# EAGLE design 27CXXX (EAGLE 6.6.0)
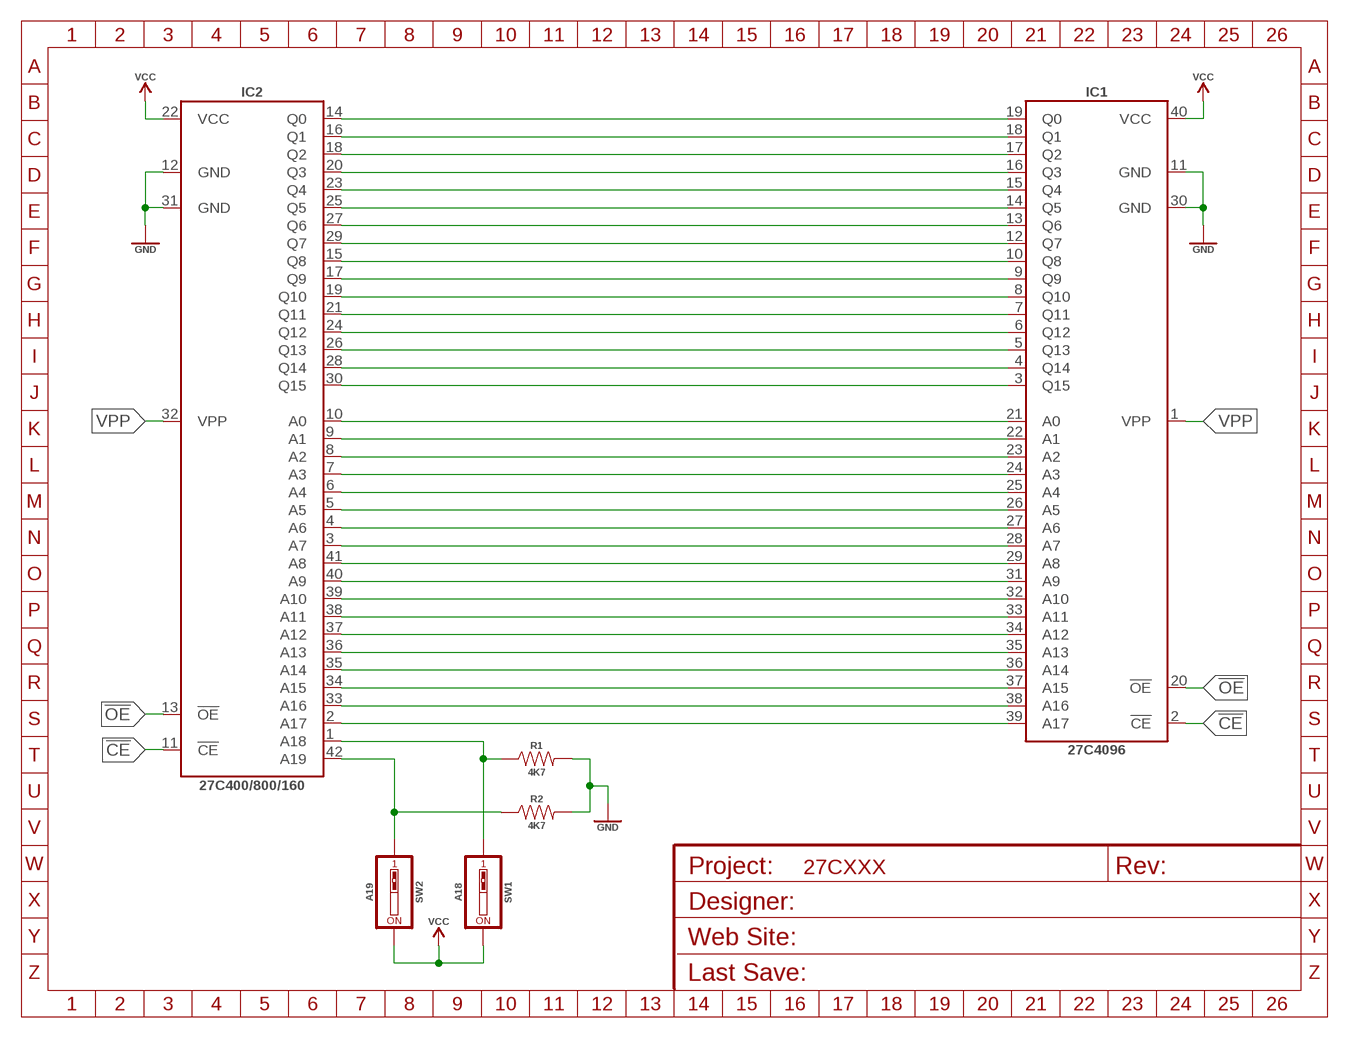
[diagram p0: schematic, sheet 1]
FRAME1 (A5L_FRAME): DESIGNER: Simon/CGTr; REVISION: 1.0; WEBSITE: http://www.commodore.gen.tr

## Parts
IC1  27C4096  27C4096_DIP  [DIP40W]
IC2  27C400/800/160  27C160_ZIF42F  [ZIF42F]
R1  4K7  RESISTOR_THT_0.3  [RESISTOR_0.3]
R2  4K7  RESISTOR_THT_0.3  [RESISTOR_0.3]
SW1  A18  SWITCH_DIP_01  [SWITCH_DIP_01]
SW2  A19  SWITCH_DIP_01  [SWITCH_DIP_01]

## Nets
!CE: IC1.2(!CE) IC2.11(!CE)
!OE: IC1.20(!OE) IC2.13(!OE)
A0: IC1.21(A0) IC2.10(A0)
A1: IC1.22(A1) IC2.9(A1)
A2: IC1.23(A2) IC2.8(A2)
A3: IC1.24(A3) IC2.7(A3)
A4: IC1.25(A4) IC2.6(A4)
A5: IC1.26(A5) IC2.5(A5)
A6: IC1.27(A6) IC2.4(A6)
A7: IC1.28(A7) IC2.3(A7)
A8: IC1.29(A8) IC2.41(A8)
A9: IC1.31(A9) IC2.40(A9)
A10: IC1.32(A10) IC2.39(A10)
A11: IC1.33(A11) IC2.38(A11)
A12: IC1.34(A12) IC2.37(A12)
A13: IC1.35(A13) IC2.36(A13)
A14: IC1.36(A14) IC2.35(A14)
A15: IC1.37(A15) IC2.34(A15)
A16: IC1.38(A16) IC2.33(A16)
A17: IC1.39(A17) IC2.2(A17)
A18: IC2.1(A18) R1.1 SW1.1
A19: IC2.42(A19) R2.1 SW2.1
GND: IC1.11(GND) IC1.30(GND) IC2.12(GND) IC2.31(GND) R1.2 R2.2
Q0: IC1.19(Q0) IC2.14(Q0)
Q1: IC1.18(Q1) IC2.16(Q1)
Q2: IC1.17(Q2) IC2.18(Q2)
Q3: IC1.16(Q3) IC2.20(Q3)
Q4: IC1.15(Q4) IC2.23(Q4)
Q5: IC1.14(Q5) IC2.25(Q5)
Q6: IC1.13(Q6) IC2.27(Q6)
Q7: IC1.12(Q7) IC2.29(Q7)
Q8: IC1.10(Q8) IC2.15(Q8)
Q9: IC1.9(Q9) IC2.17(Q9)
Q10: IC1.8(Q10) IC2.19(Q10)
Q11: IC1.7(Q11) IC2.21(Q11)
Q12: IC1.6(Q12) IC2.24(Q12)
Q13: IC1.5(Q13) IC2.26(Q13)
Q14: IC1.4(Q14) IC2.28(Q14)
Q15: IC1.3(Q15) IC2.30(Q15)
VCC: IC1.40(VCC) IC2.22(VCC) SW1.2 SW2.2
VPP: IC1.1(VPP) IC2.32(VPP)

## Library data of the parts
IC1 = sj_ic:27C4096: 27C4096 4 Mbit (256 Kbit x 16) EPROM
IC2 = sj_ic:27C160: 27C160 16 Mbit (2048 Kbit x 8 or 1024 Kbit x 16) EPROM
R1 R2 = sj_standart:RESISTOR: Resistor
SW1 SW2 = sj_standart:SWITCH_DIP_01: 1-bit DIP Switch

## Board
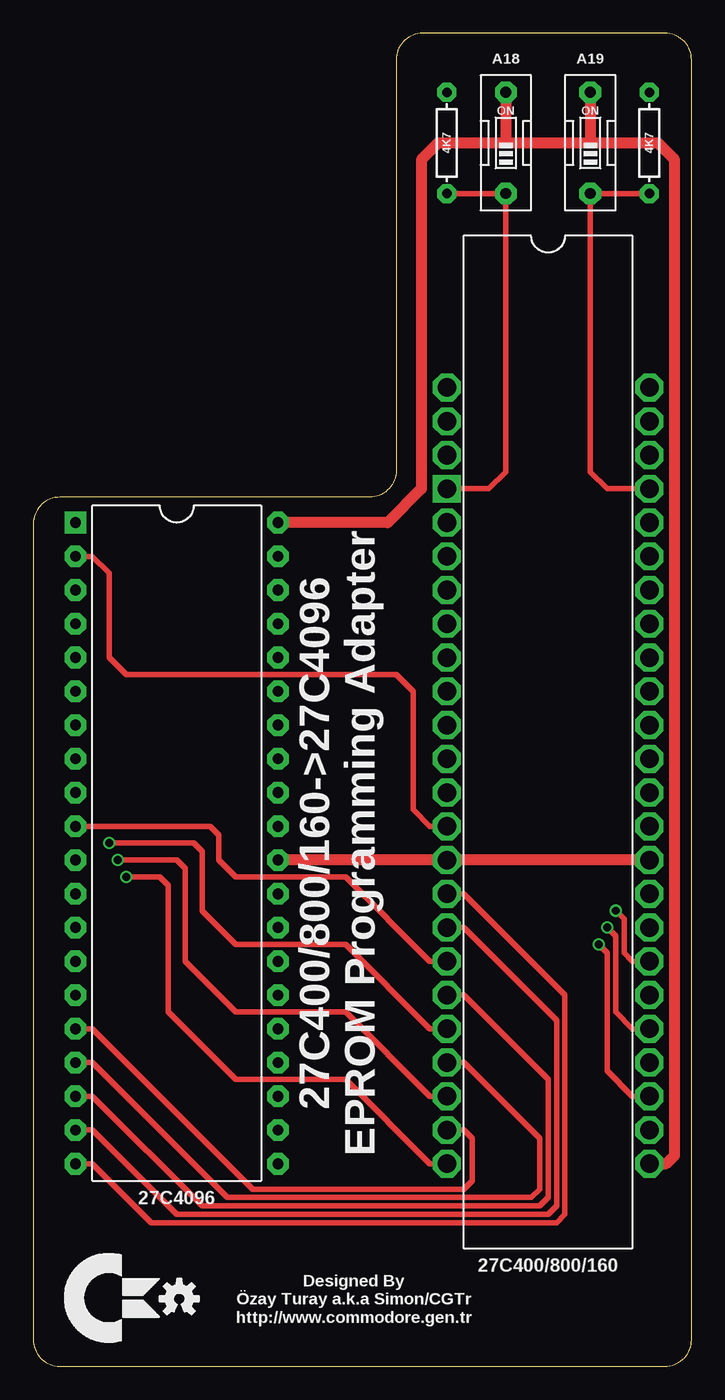
[diagram p1: board, top side]
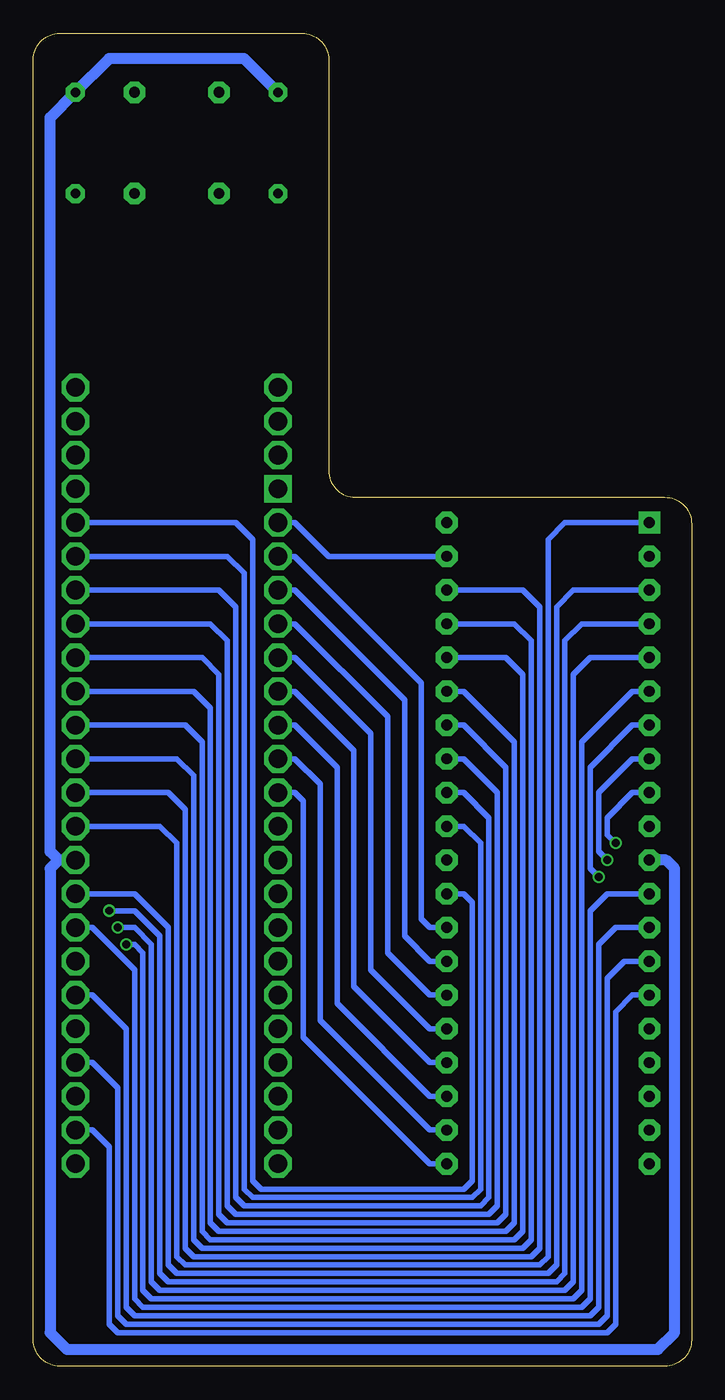
[diagram p2: board, bottom side, seen from below]

Size 49.53 x 100.33 mm. Coordinates in mm from the lower left corner, seen from the top.
Outline: 0,63.41 0,2 arc90 2,0 47.53,0 arc90 49.53,2 49.53,98.33 arc90 47.53,100.33 29.3,100.33 arc90 27.3,98.33 27.3,67.41 arc-90 25.3,65.41 2,65.41 arc90 0,63.41
Copper layers (1*16): Top 0.035mm / dielectric 1.5mm / Bottom 0.035mm
Design rules "DirtyPCBs": minimum track width 5mil, minimum drill 12mil, track to track 5mil, track to pad 5mil, pad to pad 5mil, via to via 5mil, smd to smd 0mil, copper to edge 10mil, drill to drill 10mil, minimum pad ring 10mil, minimum via ring 6mil, stop-mask expansion 2mil, vias tented up to drill 25mil, thermal gap 10mil

### Footprints (pad centres in the part's own frame; a part is rotated, then mirrored left to right if it is on the bottom)
DIP40W = drill 0.813 pad 1.626 square: 1 -24.13,-7.62 | drill 0.813 pad 1.626 octagon: 2 -21.59,-7.62; 3 -19.05,-7.62; 4 -16.51,-7.62; 5 -13.97,-7.62; 6 -11.43,-7.62; 7 -8.89,-7.62; 8 -6.35,-7.62; 9 -3.81,-7.62; 10 -1.27,-7.62; 11 1.27,-7.62; 12 3.81,-7.62; 13 6.35,-7.62; 14 8.89,-7.62; 15 11.43,-7.62; 16 13.97,-7.62; 17 16.51,-7.62; 18 19.05,-7.62; 19 21.59,-7.62; 20 24.13,-7.62; 21 24.13,7.62; 22 21.59,7.62; 23 19.05,7.62; 24 16.51,7.62; 25 13.97,7.62; 26 11.43,7.62; 27 8.89,7.62; 28 6.35,7.62; 29 3.81,7.62; 30 1.27,7.62; 31 -1.27,7.62; 32 -3.81,7.62; 33 -6.35,7.62; 34 -8.89,7.62; 35 -11.43,7.62; 36 -13.97,7.62; 37 -16.51,7.62; 38 -19.05,7.62; 39 -21.59,7.62; 40 -24.13,7.62
ZIF42F = drill 1.397 pad 2.032 square: 1 -25.4,-7.62 | drill 1.397 pad 2.032 octagon: 2 -22.86,-7.62; 3 -20.32,-7.62; 4 -17.78,-7.62; 5 -15.24,-7.62; 6 -12.7,-7.62; 7 -10.16,-7.62; 8 -7.62,-7.62; 9 -5.08,-7.62; 10 -2.54,-7.62; 11 0,-7.62; 12 2.54,-7.62; 13 5.08,-7.62; 14 7.62,-7.62; 15 10.16,-7.62; 16 12.7,-7.62; 17 15.24,-7.62; 18 17.78,-7.62; 19 20.32,-7.62; 20 22.86,-7.62; 21 25.4,-7.62; 22 25.4,7.62; 23 22.86,7.62; 24 20.32,7.62; 25 17.78,7.62; 26 15.24,7.62; 27 12.7,7.62; 28 10.16,7.62; 29 7.62,7.62; 30 5.08,7.62; 31 2.54,7.62; 32 0,7.62; 33 -2.54,7.62; 34 -5.08,7.62; 35 -7.62,7.62; 36 -10.16,7.62; 37 -12.7,7.62; 38 -15.24,7.62; 39 -17.78,7.62; 40 -20.32,7.62; 41 -22.86,7.62; 42 -25.4,7.62; F1 -33.02,-7.62; F2 -30.48,-7.62; F3 -27.94,-7.62; F4 -27.94,7.62; F5 -30.48,7.62; F6 -33.02,7.62
RESISTOR_0.3 = drill 0.711 pad 1.422 octagon: 1 -3.81,0; 2 3.81,0
SWITCH_DIP_01 = drill 0.813 pad 1.626 octagon: 1 0,-3.81; 2 0,3.81

### Placement (x,y rotation side)
IC1  10.79,39.37 270 top
IC2  38.73,40.64 270 top
LOGO1  OSHW_LOGO_SMALL  [OSHW_LOGO_SMALL]  10.99,5.08 0 top
R1  31.11,92.08 90 top
R2  46.35,92.08 90 top
SW1  35.56,92.08 0 top
SW2  41.91,92.08 0 top

### Tracks (layer width: path | path; a pad name or v marks a point on that pad's centre or on a via)
!CE
  Top 0.406: IC1.2 4.45,60.96 5.71,59.69 5.71,53.34 6.99,52.07 27.3,52.07 28.57,50.8 28.57,41.91 29.84,40.64 IC2.11
!OE
  Top 0.406: IC1.20 4.45,15.24 8.89,10.79 39.37,10.79 40.01,11.43 40.01,27.94 32.38,35.56 IC2.13
A0
  Bottom 0.406: IC1.21 19.68,15.24 29.21,24.77 29.21,42.55 29.84,43.18 IC2.10
A1
  Bottom 0.406: IC1.22 19.68,17.78 27.94,26.04 27.94,43.81 29.84,45.72 IC2.9
A2
  Bottom 0.406: IC1.23 19.68,20.32 26.67,27.3 26.67,45.09 29.84,48.26 IC2.8
A3
  Bottom 0.406: IC1.24 19.68,22.86 25.4,28.57 25.4,46.35 29.84,50.8 IC2.7
A4
  Bottom 0.406: IC1.25 19.68,25.4 24.13,29.84 24.13,47.62 29.84,53.34 IC2.6
A5
  Bottom 0.406: IC1.26 19.68,27.94 22.86,31.11 22.86,48.9 29.84,55.88 IC2.5
A6
  Bottom 0.406: IC1.27 19.68,30.48 21.59,32.38 21.59,50.16 29.84,58.42 IC2.4
A7
  Bottom 0.406: IC1.28 19.68,33.02 20.32,33.66 20.32,51.44 29.84,60.96 IC2.3
A8
  Bottom 0.406: IC1.29 17.14,35.56 16.51,34.92 16.51,13.97 17.14,13.34 32.38,13.34 33.02,13.97 33.02,62.23 34.29,63.5 IC2.41
A9
  Bottom 0.406: IC1.31 17.14,40.64 15.88,39.37 15.88,13.34 16.51,12.7 33.02,12.7 33.66,13.34 33.66,59.69 34.92,60.96 IC2.40
A10
  Bottom 0.406: IC1.32 17.14,43.18 15.24,41.27 15.24,12.7 15.88,12.06 33.66,12.06 34.29,12.7 34.29,57.15 35.56,58.42 IC2.39
A11
  Bottom 0.406: IC1.33 17.14,45.72 14.61,43.18 14.61,12.06 15.24,11.43 34.29,11.43 34.92,12.06 34.92,54.61 36.2,55.88 IC2.38
A12
  Bottom 0.406: IC1.34 17.14,48.26 13.97,45.09 13.97,11.43 14.61,10.79 34.92,10.79 35.56,11.43 35.56,52.07 36.83,53.34 IC2.37
A13
  Bottom 0.406: IC1.35 17.14,50.8 13.34,46.99 13.34,10.79 13.97,10.16 35.56,10.16 36.2,10.79 36.2,49.53 37.47,50.8 IC2.36
A14
  Bottom 0.406: IC1.36 13.97,53.34 12.7,52.07 12.7,10.16 13.34,9.53 36.2,9.53 36.83,10.16 36.83,46.99 38.1,48.26 IC2.35
A15
  Bottom 0.406: IC1.37 13.34,55.88 12.06,54.61 12.06,9.53 12.7,8.89 36.83,8.89 37.47,9.53 37.47,44.45 38.73,45.72 IC2.34
A16
  Bottom 0.406: IC1.38 12.7,58.42 11.43,57.15 11.43,8.89 12.06,8.26 37.47,8.26 38.1,8.89 38.1,41.91 39.37,43.18 IC2.33
A17
  Bottom 0.406: IC1.39 27.3,60.96 29.84,63.5 IC2.2
A18
  Top 0.406: R1.1 SW1.1 35.56,67.31 34.29,66.04 IC2.1
A19
  Top 0.406: R2.1 SW2.1 41.91,67.31 43.18,66.04 IC2.42
GND
  Top 0.813: IC2.31 IC2.12 IC1.30
  Bottom 0.813: 47.62,38.1 48.26,38.73 48.26,93.98 R2.2 43.81,98.42 33.66,98.42 R1.2 | IC2.31 47.62,38.1 | 47.62,38.1 48.26,37.47 48.26,2.54 46.99,1.27 2.54,1.27 1.27,2.54 1.27,37.47 1.91,38.1 IC1.11
Q0
  Top 0.406: IC1.19 4.45,17.78 10.79,11.43 38.73,11.43 39.37,12.06 39.37,26.04 32.38,33.02 IC2.14
Q1
  Top 0.406: IC1.18 4.45,20.32 12.7,12.06 38.1,12.06 38.73,12.7 38.73,21.59 32.38,27.94 IC2.16
Q2
  Top 0.406: IC1.17 4.45,22.86 14.61,12.7 37.47,12.7 38.1,13.34 38.1,17.14 32.38,22.86 IC2.18
Q3
  Top 0.406: IC1.16 4.45,25.4 16.51,13.34 32.38,13.34 33.02,13.97 33.02,17.14 32.38,17.78 IC2.20
Q4
  Bottom 0.406: IC1.15 4.45,27.94 5.71,26.67 5.71,3.17 6.35,2.54 43.18,2.54 43.81,3.17 43.81,16.51 45.09,17.78 IC2.23
Q5
  Bottom 0.406: IC1.14 5.08,30.48 6.35,29.21 6.35,3.81 6.99,3.17 42.55,3.17 43.18,3.81 43.18,20.95 45.09,22.86 IC2.25
Q6
  Bottom 0.406: IC1.13 5.71,33.02 6.99,31.75 6.99,4.45 7.62,3.81 41.91,3.81 42.55,4.45 42.55,25.4 45.09,27.94 IC2.27
Q7
  Bottom 0.406: IC1.12 6.35,35.56 7.62,34.29 7.62,5.08 8.26,4.45 41.27,4.45 41.91,5.08 41.91,29.84 45.09,33.02 IC2.29
Q8
  Top 0.406: IC2.15 29.84,30.48 23.5,36.83 15.24,36.83 13.97,38.1 13.97,40.01 13.34,40.64 IC1.10
Q9  (via drill 0.6)
  Top 0.406: v5.71,39.37 12.06,39.37 12.7,38.73 12.7,34.29 15.24,31.75 23.5,31.75 29.84,25.4 IC2.17
  Bottom 0.406: IC1.9 4.45,43.18 6.35,41.27 6.35,40.01 v5.71,39.37
Q10  (via drill 0.6)
  Top 0.406: v6.35,38.1 10.79,38.1 11.43,37.47 11.43,30.48 15.24,26.67 23.5,26.67 29.84,20.32 IC2.19
  Bottom 0.406: IC1.8 4.45,45.72 6.99,43.18 6.99,38.73 v6.35,38.1
Q11  (via drill 0.6)
  Top 0.406: v6.99,36.83 9.53,36.83 10.16,36.2 10.16,26.67 15.24,21.59 23.5,21.59 29.84,15.24 IC2.21
  Bottom 0.406: IC1.7 4.45,48.26 7.62,45.09 7.62,37.47 v6.99,36.83
Q12  (via drill 0.6)
  Top 0.406: v42.55,31.75 43.18,31.11 43.18,22.23 45.09,20.32 IC2.24
  Bottom 0.406: IC1.6 4.45,50.8 8.26,46.99 8.26,5.71 8.89,5.08 40.64,5.08 41.27,5.71 41.27,31.11 41.91,31.75 v42.55,31.75
Q13  (via drill 0.6)
  Top 0.406: v43.18,33.02 43.81,32.38 43.81,26.67 45.09,25.4 IC2.26
  Bottom 0.406: IC1.5 7.62,53.34 8.89,52.07 8.89,6.35 9.53,5.71 40.01,5.71 40.64,6.35 40.64,31.75 41.91,33.02 v43.18,33.02
Q14  (via drill 0.6)
  Top 0.406: v43.81,34.29 44.45,33.66 44.45,31.11 45.09,30.48 IC2.28
  Bottom 0.406: IC1.4 8.26,55.88 9.53,54.61 9.53,6.99 10.16,6.35 39.37,6.35 40.01,6.99 40.01,32.38 41.91,34.29 v43.81,34.29
Q15
  Bottom 0.406: IC1.3 8.89,58.42 10.16,57.15 10.16,7.62 10.79,6.99 38.73,6.99 39.37,7.62 39.37,33.02 41.91,35.56 IC2.30
VCC
  Top 0.813: IC2.22 47.62,15.24 48.26,15.88 48.26,90.81 46.99,92.08 41.91,92.08 | IC1.40 26.67,63.5 29.21,66.04 29.21,90.81 30.48,92.08 35.56,92.08 | 35.56,92.08 41.91,92.08 | SW1.2 35.56,92.08 | SW2.2 41.91,92.08
VPP
  Bottom 0.406: IC1.1 9.53,63.5 10.79,62.23 10.79,8.26 11.43,7.62 38.1,7.62 38.73,8.26 38.73,39.37 40.01,40.64 IC2.32

### Text on the board
tPlace: 27C400/800/160->27C4096 / EPROM Programming Adapter | Designed By / Özay Turay a.k.a Simon/CGTr / http://www.commodore.gen.tr